# EAGLE design DINx2 (EAGLE 6.4)
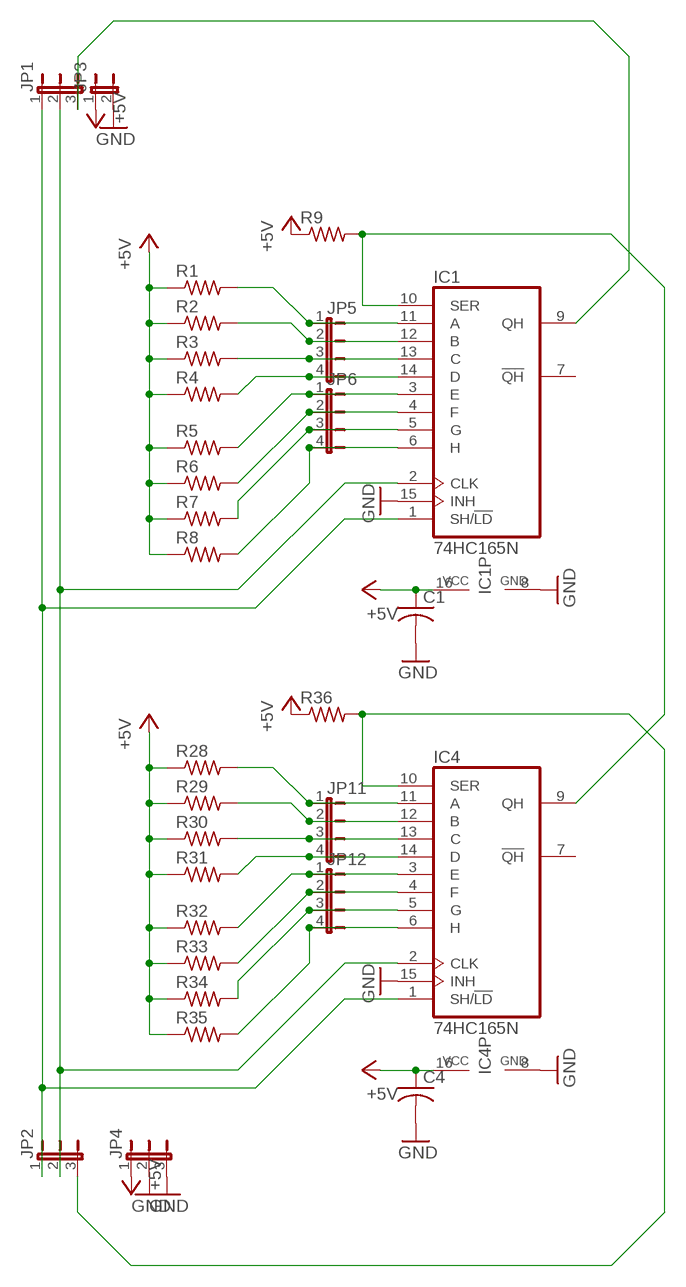
[diagram p0: schematic, sheet 1]

## Parts
C1  C-US025-025X050  [C025-025X050]
C4  C-US025-025X050  [C025-025X050]
IC1  74HC165N  [DIL16]
IC4  74HC165N  [DIL16]
JP1  JP2E  [JP2]
JP2  JP2E  [JP2]
JP3  JP1E  [JP1]
JP4  JP2E  [JP2]
JP5  JP4E  [JP4]
JP6  JP4E  [JP4]
JP11  JP4E  [JP4]
JP12  JP4E  [JP4]
R1  R-US_0207/2V  [0207/2V]
R2  R-US_0207/2V  [0207/2V]
R3  R-US_0207/2V  [0207/2V]
R4  R-US_0207/2V  [0207/2V]
R5  R-US_0207/2V  [0207/2V]
R6  R-US_0207/2V  [0207/2V]
R7  R-US_0207/2V  [0207/2V]
R8  R-US_0207/2V  [0207/2V]
R9  R-US_0207/2V  [0207/2V]
R28  R-US_0207/2V  [0207/2V]
R29  R-US_0207/2V  [0207/2V]
R30  R-US_0207/2V  [0207/2V]
R31  R-US_0207/2V  [0207/2V]
R32  R-US_0207/2V  [0207/2V]
R33  R-US_0207/2V  [0207/2V]
R34  R-US_0207/2V  [0207/2V]
R35  R-US_0207/2V  [0207/2V]
R36  R-US_0207/2V  [0207/2V]

## Nets
+5V: C1.1 C4.1 IC1.16(VCC) IC4.16(VCC) JP3.1 JP4.1 R1.1 R2.1 R3.1 R4.1 R5.1 R6.1 R7.1 R8.1 R9.1 R28.1 R29.1 R30.1 R31.1 R32.1 R33.1 R34.1 R35.1 R36.1
GND: C1.2 C4.2 IC1.8(GND) IC1.15(INH) IC4.8(GND) IC4.15(INH) JP3.2 JP4.2 JP4.3
N$1: IC1.11(A) JP5.1 R1.2
N$2: IC1.12(B) JP5.2 R2.2
N$3: IC1.3(E) JP6.1 R5.2
N$4: IC1.13(C) JP5.3 R3.2
N$5: IC1.14(D) JP5.4 R4.2
N$6: IC1.4(F) JP6.2 R6.2
N$7: IC1.5(G) JP6.3 R7.2
N$8: IC1.6(H) JP6.4 R8.2
N$9: IC1.9(QH) JP1.3
N$11: IC1.1(SH/!LD) IC4.1(SH/!LD) JP1.1 JP2.1
N$33: IC1.2(CLK) IC4.2(CLK) JP1.2 JP2.2
N$37: IC4.11(A) JP11.1 R28.2
N$38: IC4.13(C) JP11.3 R30.2
N$39: IC4.14(D) JP11.4 R31.2
N$40: IC4.12(B) JP11.2 R29.2
N$41: IC4.3(E) JP12.1 R32.2
N$42: IC4.5(G) JP12.3 R34.2
N$43: IC4.6(H) JP12.4 R35.2
N$44: IC4.4(F) JP12.2 R33.2
N$47: IC1.10(SER) IC4.9(QH) R9.2
N$48: IC4.10(SER) JP2.3 R36.2
Unconnected: IC1.7(!QH) IC4.7(!QH)

## Library data of the parts
C1 C4 = rcl:C-US: CAPACITOR, American symbol
IC1 IC4 = 74xx-eu:74*165: 8-bit parallel load SHIFT REGISTER
JP1 JP2 JP4 = jumper:JP2E: JUMPER
JP3 = jumper:JP1E: JUMPER
JP5 JP6 JP11 JP12 = jumper:JP4E: JUMPER
R1-R9 R28-R36 = rcl:R-US_: RESISTOR, American symbol

## Board
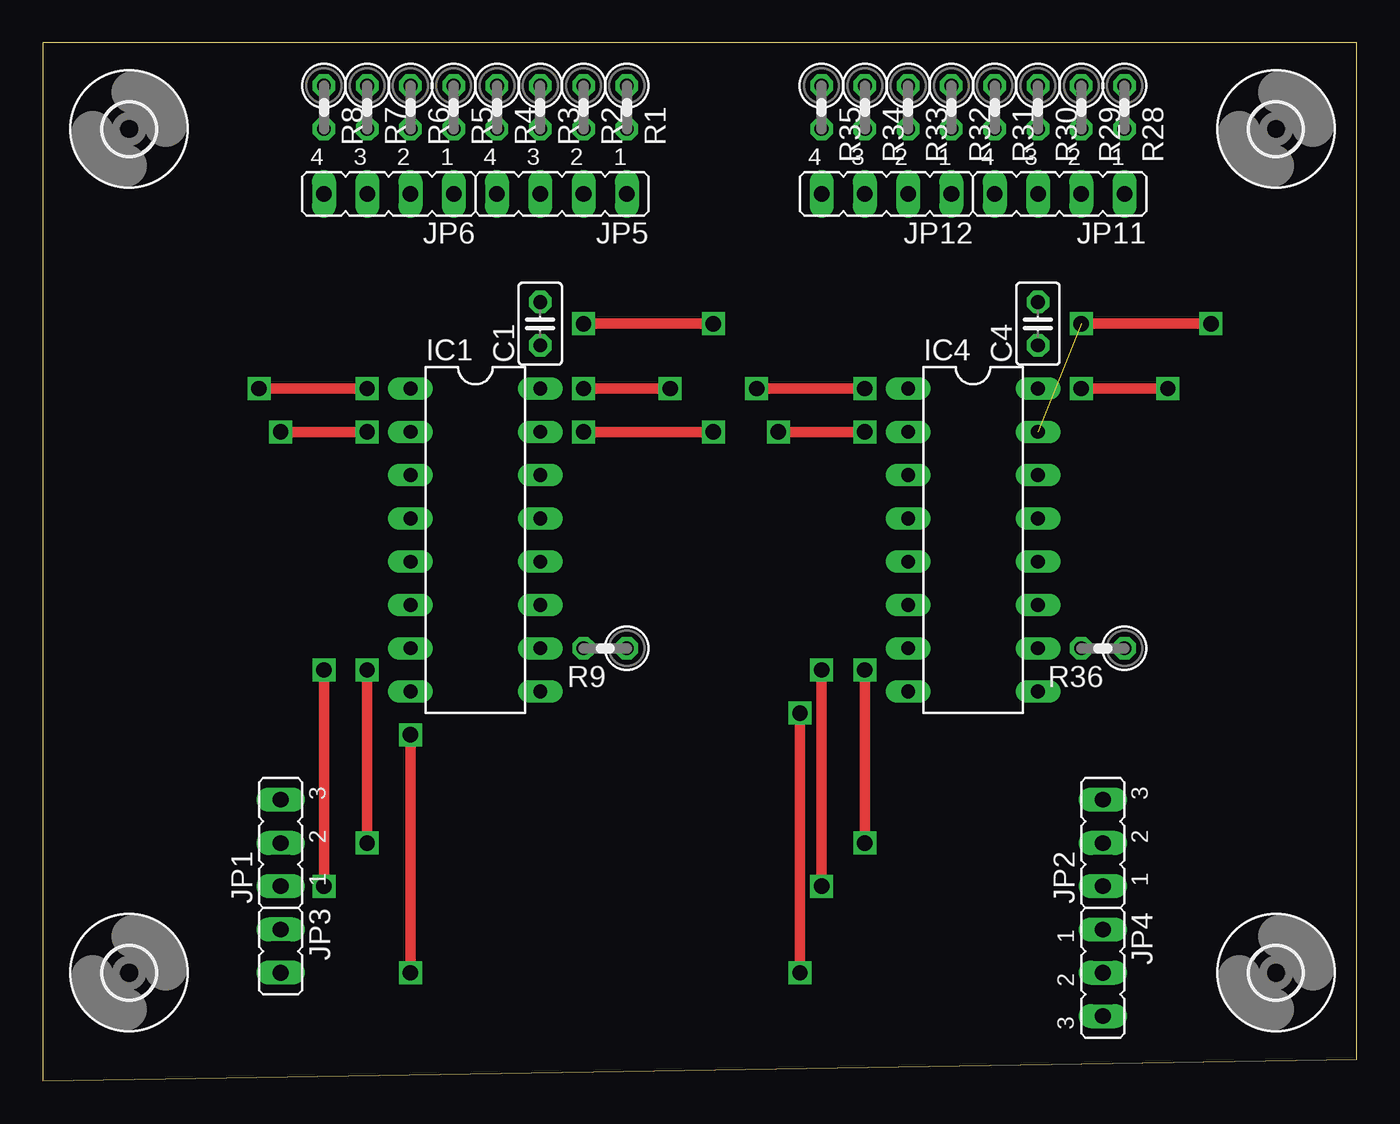
[diagram p1: board, top side]
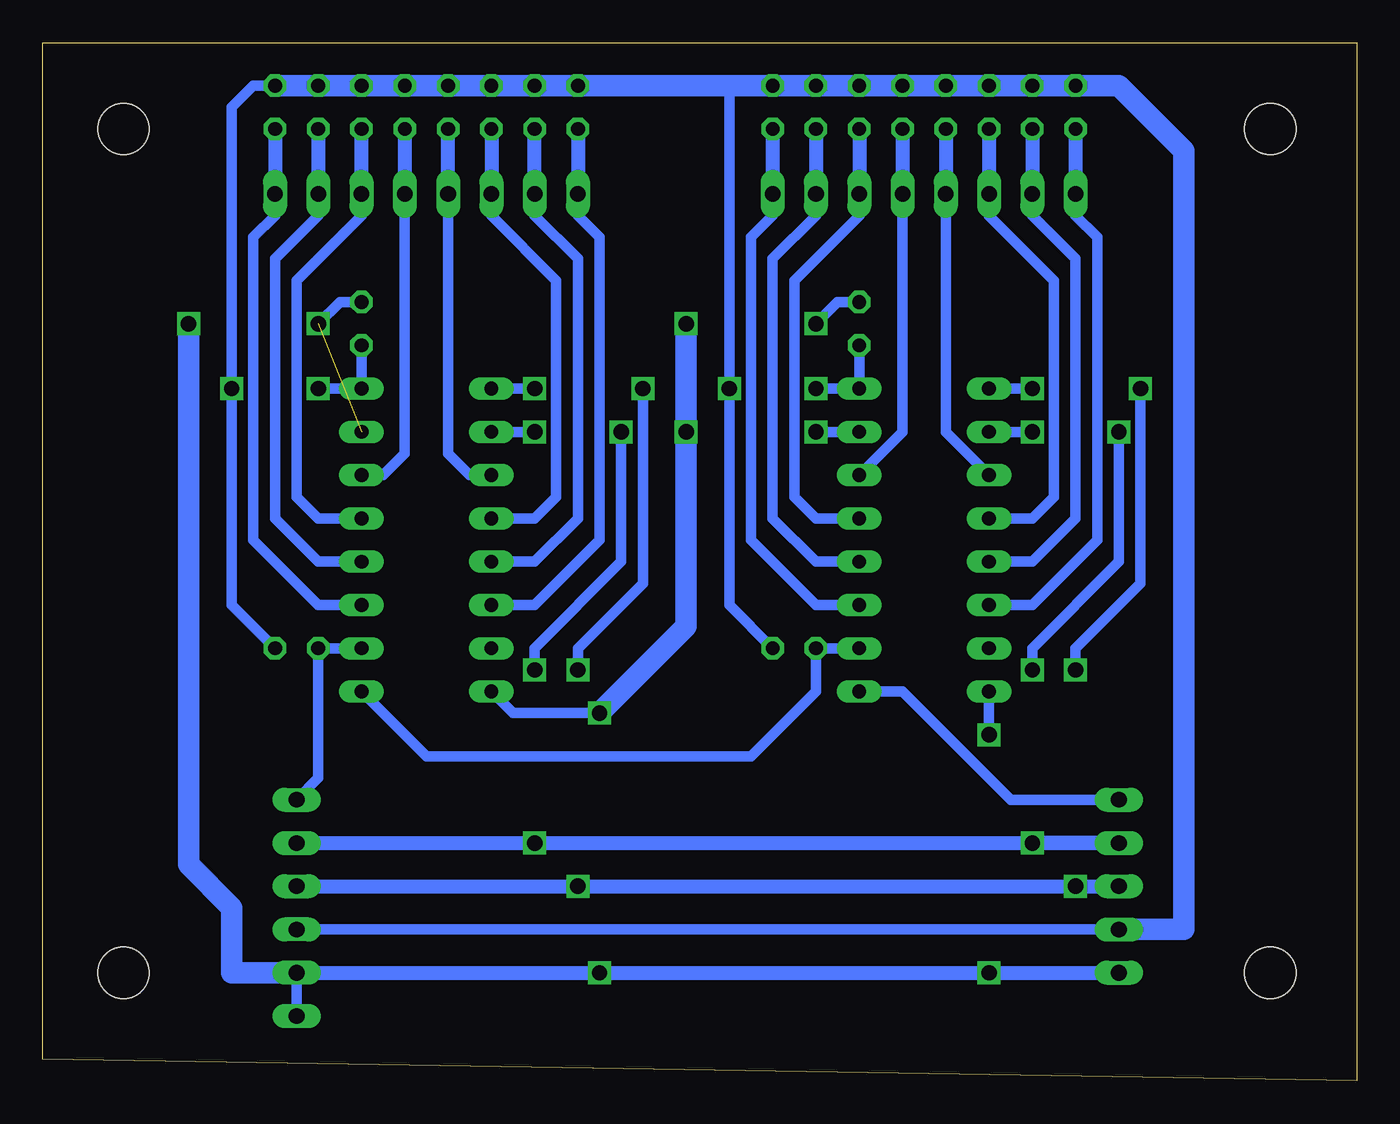
[diagram p2: board, bottom side, seen from below]

Size 77.14 x 60.95 mm. Coordinates in mm from the lower left corner, seen from the top.
Outline: 0,0 77.14,1.27 77.14,60.95 0,60.95 0,0
Copper layers (1*16): Top 0.035mm / dielectric 1.5mm / Bottom 0.035mm
Design rules "default": minimum track width 10mil, minimum drill 24mil, track to track 8mil, track to pad 8mil, pad to pad 8mil, via to via 8mil, smd to smd 8mil, copper to edge 40mil, drill to drill 8mil, minimum pad ring 10mil, minimum via ring 8mil, stop-mask expansion 4mil, vias tented up to drill 0mil, thermal gap 10mil

### Footprints (pad centres in the part's own frame; a part is rotated, then mirrored left to right if it is on the bottom)
C025-025X050 = drill 0.813 octagon: 1 -1.27,0; 2 1.27,0
DIL16 = drill 0.813 long: 1 -8.89,-3.81; 2 -6.35,-3.81; 3 -3.81,-3.81; 4 -1.27,-3.81; 5 1.27,-3.81; 6 3.81,-3.81; 7 6.35,-3.81; 8 8.89,-3.81; 9 8.89,3.81; 10 6.35,3.81; 11 3.81,3.81; 12 1.27,3.81; 13 -1.27,3.81; 14 -3.81,3.81; 15 -6.35,3.81; 16 -8.89,3.81
JP2 = drill 0.914 long: 1 -2.54,0; 2 0,0; 3 2.54,0
JP1 = drill 0.914 long: 1 0,-1.27; 2 0,1.27
JP4 = drill 0.914 long: 1 -3.81,0; 2 -1.27,0; 3 1.27,0; 4 3.81,0
0207/2V = drill 0.813 octagon: 1 -1.27,0; 2 1.27,0
3,0 = hole 3: 0,0

### Placement (x,y rotation side)
C1  29.21,44.45 90 top
C4  58.42,44.45 90 top
IC1  25.4,31.75 270 top
IC4  54.61,31.75 270 top
JP1  13.97,13.97 90 top
JP2  62.23,13.97 90 top
JP3  13.97,7.62 180 top
JP4  62.23,6.35 270 top
JP5  30.48,52.07 180 top
JP6  20.32,52.07 180 top
JP11  59.69,52.07 180 top
JP12  49.53,52.07 180 top
R1  34.29,57.15 270 top
R2  31.75,57.15 270 top
R3  29.21,57.15 270 top
R4  26.67,57.15 270 top
R5  24.13,57.15 270 top
R6  21.59,57.15 270 top
R7  19.05,57.15 270 top
R8  16.51,57.15 270 top
R9  33.02,25.4 180 top
R28  63.5,57.15 270 top
R29  60.96,57.15 270 top
R30  58.42,57.15 270 top
R31  55.88,57.15 270 top
R32  53.34,57.15 270 top
R33  50.8,57.15 270 top
R34  48.26,57.15 270 top
R35  45.72,57.15 270 top
R36  62.23,25.4 180 top
U$1  [3,0]  5.08,6.35 0 top
U$2  [3,0]  72.39,55.88 0 top
U$3  [3,0]  72.39,6.35 0 top
U$4  [3,0]  5.08,55.88 0 top

### Tracks (layer width: path | path; a pad name or v marks a point on that pad's centre or on a via)
+5V  (via drill 0.9)
  Top 0.61: v31.75,40.64 v36.83,40.64 | v60.96,40.64 v66.04,40.64
  Bottom 0.61: R9.1 36.83,27.94 v36.83,40.64 36.83,58.42 | R8.1 R7.1 R6.1 R5.1 R4.1 | R35.1 R34.1 R33.1 R32.1 R31.1 R30.1 R29.1 R28.1 64.77,58.42 66.04,57.15 v66.04,40.64 66.04,27.94 R36.1 | C1.1 IC1.16 v31.75,40.64 | JP4.1 JP3.1 | C4.1 IC4.16 v60.96,40.64
  Bottom 1.27: JP3.1 10.16,8.89 10.16,54.61 13.97,58.42 R8.1 R3.1 R2.1 R1.1 36.83,58.42 R35.1 R28.1
GND  (via drill 0.9)  (1 unrouted)
  Top 0.61: v21.59,20.32 v21.59,6.35 | v44.45,21.59 v44.45,6.35 | v31.75,38.1 v39.37,38.1 | v31.75,44.45 v39.37,44.45 | v60.96,44.45 v68.58,44.45
  Bottom 0.61: v31.75,44.45 30.48,45.72 C1.2 | IC4.8 49.53,21.59 v44.45,21.59 | IC1.8 v21.59,20.32 | IC1.15 v31.75,38.1 | JP4.3 JP4.2 | C4.2 59.69,45.72 v60.96,44.45
  Bottom 0.813: JP3.2 v21.59,6.35 v44.45,6.35 JP4.2
  Bottom 1.27: v39.37,44.45 v39.37,38.1 39.37,26.67 v44.45,21.59 | v68.58,44.45 68.58,12.7 66.04,10.16 66.04,6.35 JP4.2
N$1
  Bottom 0.61: JP5.1 34.29,50.8 35.56,49.53 35.56,31.75 31.75,27.94 IC1.11
  Bottom 0.813: R1.2 JP5.1
N$2
  Bottom 0.61: IC1.12 31.75,30.48 34.29,33.02 34.29,48.26 31.75,50.8 JP5.2
  Bottom 0.813: R2.2 JP5.2
N$3
  Bottom 0.61: IC1.3 24.13,38.1 JP6.1
  Bottom 0.813: R5.2 JP6.1
N$4
  Bottom 0.61: JP5.3 29.21,50.8 33.02,46.99 33.02,34.29 31.75,33.02 IC1.13
  Bottom 0.813: R3.2 JP5.3
N$5
  Bottom 0.61: JP5.4 26.67,38.1 IC1.14
  Bottom 0.813: R4.2 JP5.4
N$6
  Bottom 0.61: JP6.2 21.59,50.8 17.78,46.99 17.78,34.29 19.05,33.02 IC1.4
  Bottom 0.813: R6.2 JP6.2
N$7
  Bottom 0.61: IC1.5 19.05,30.48 16.51,33.02 16.51,48.26 19.05,50.8 JP6.3
  Bottom 0.813: R7.2 JP6.3
N$8
  Bottom 0.61: JP6.4 16.51,50.8 15.24,49.53 15.24,31.75 19.05,27.94 IC1.6
  Bottom 0.813: R8.2 JP6.4
N$9
  Bottom 0.61: JP1.3 20.32,16.51 26.67,22.86 IC1.9
N$11  (via drill 0.9)
  Top 0.61: v19.05,40.64 v12.7,40.64 | v48.26,40.64 v41.91,40.64 | v45.72,24.13 v45.72,11.43 | v16.51,24.13 v16.51,11.43
  Bottom 0.61: IC1.1 v19.05,40.64 | IC4.1 v48.26,40.64 | v12.7,40.64 12.7,29.21 16.51,25.4 v16.51,24.13 | v41.91,40.64 41.91,29.21 45.72,25.4 v45.72,24.13
  Bottom 0.813: JP1.1 v16.51,11.43 v45.72,11.43 JP2.1
N$33  (via drill 0.9)
  Top 0.61: v48.26,38.1 v43.18,38.1 | v48.26,24.13 v48.26,13.97 | v19.05,38.1 v13.97,38.1 | v19.05,24.13 v19.05,13.97
  Bottom 0.61: IC4.2 v48.26,38.1 | v43.18,38.1 43.18,30.48 48.26,25.4 v48.26,24.13 | IC1.2 v19.05,38.1 | v13.97,38.1 13.97,30.48 19.05,25.4 v19.05,24.13
  Bottom 0.813: v19.05,13.97 JP1.2 v48.26,13.97 JP2.2
N$37
  Bottom 0.61: IC4.11 60.96,27.94 64.77,31.75 64.77,49.53 63.5,50.8 JP11.1
  Bottom 0.813: R28.2 JP11.1
N$38
  Bottom 0.61: JP11.3 58.42,50.8 62.23,46.99 62.23,34.29 60.96,33.02 IC4.13
  Bottom 0.813: JP11.3 R30.2
N$39
  Bottom 0.61: IC4.14 57.15,35.56 55.88,36.83 JP11.4
  Bottom 0.813: R31.2 JP11.4
N$40
  Bottom 0.61: JP11.2 60.96,50.8 63.5,48.26 63.5,33.02 60.96,30.48 IC4.12
  Bottom 0.813: R29.2 JP11.2
N$41
  Bottom 0.61: JP12.1 53.34,36.83 52.07,35.56 IC4.3
  Bottom 0.813: JP12.1 R32.2
N$42
  Bottom 0.61: IC4.5 48.26,30.48 45.72,33.02 45.72,48.26 48.26,50.8 JP12.3
  Bottom 0.813: JP12.3 R34.2
N$43
  Bottom 0.61: JP12.4 45.72,50.8 44.45,49.53 44.45,31.75 48.26,27.94 IC4.6
  Bottom 0.813: R35.2 JP12.4
N$44
  Bottom 0.61: JP12.2 50.8,50.8 46.99,46.99 46.99,34.29 48.26,33.02 IC4.4
  Bottom 0.813: R33.2 JP12.2
N$47
  Bottom 0.61: IC1.10 R9.2 31.75,22.86 35.56,19.05 54.61,19.05 IC4.9
N$48
  Bottom 0.61: JP2.3 60.96,17.78 R36.2 IC4.10